# EAGLE schematic BattleBits_V2_manual (EAGLE 9.3.2)
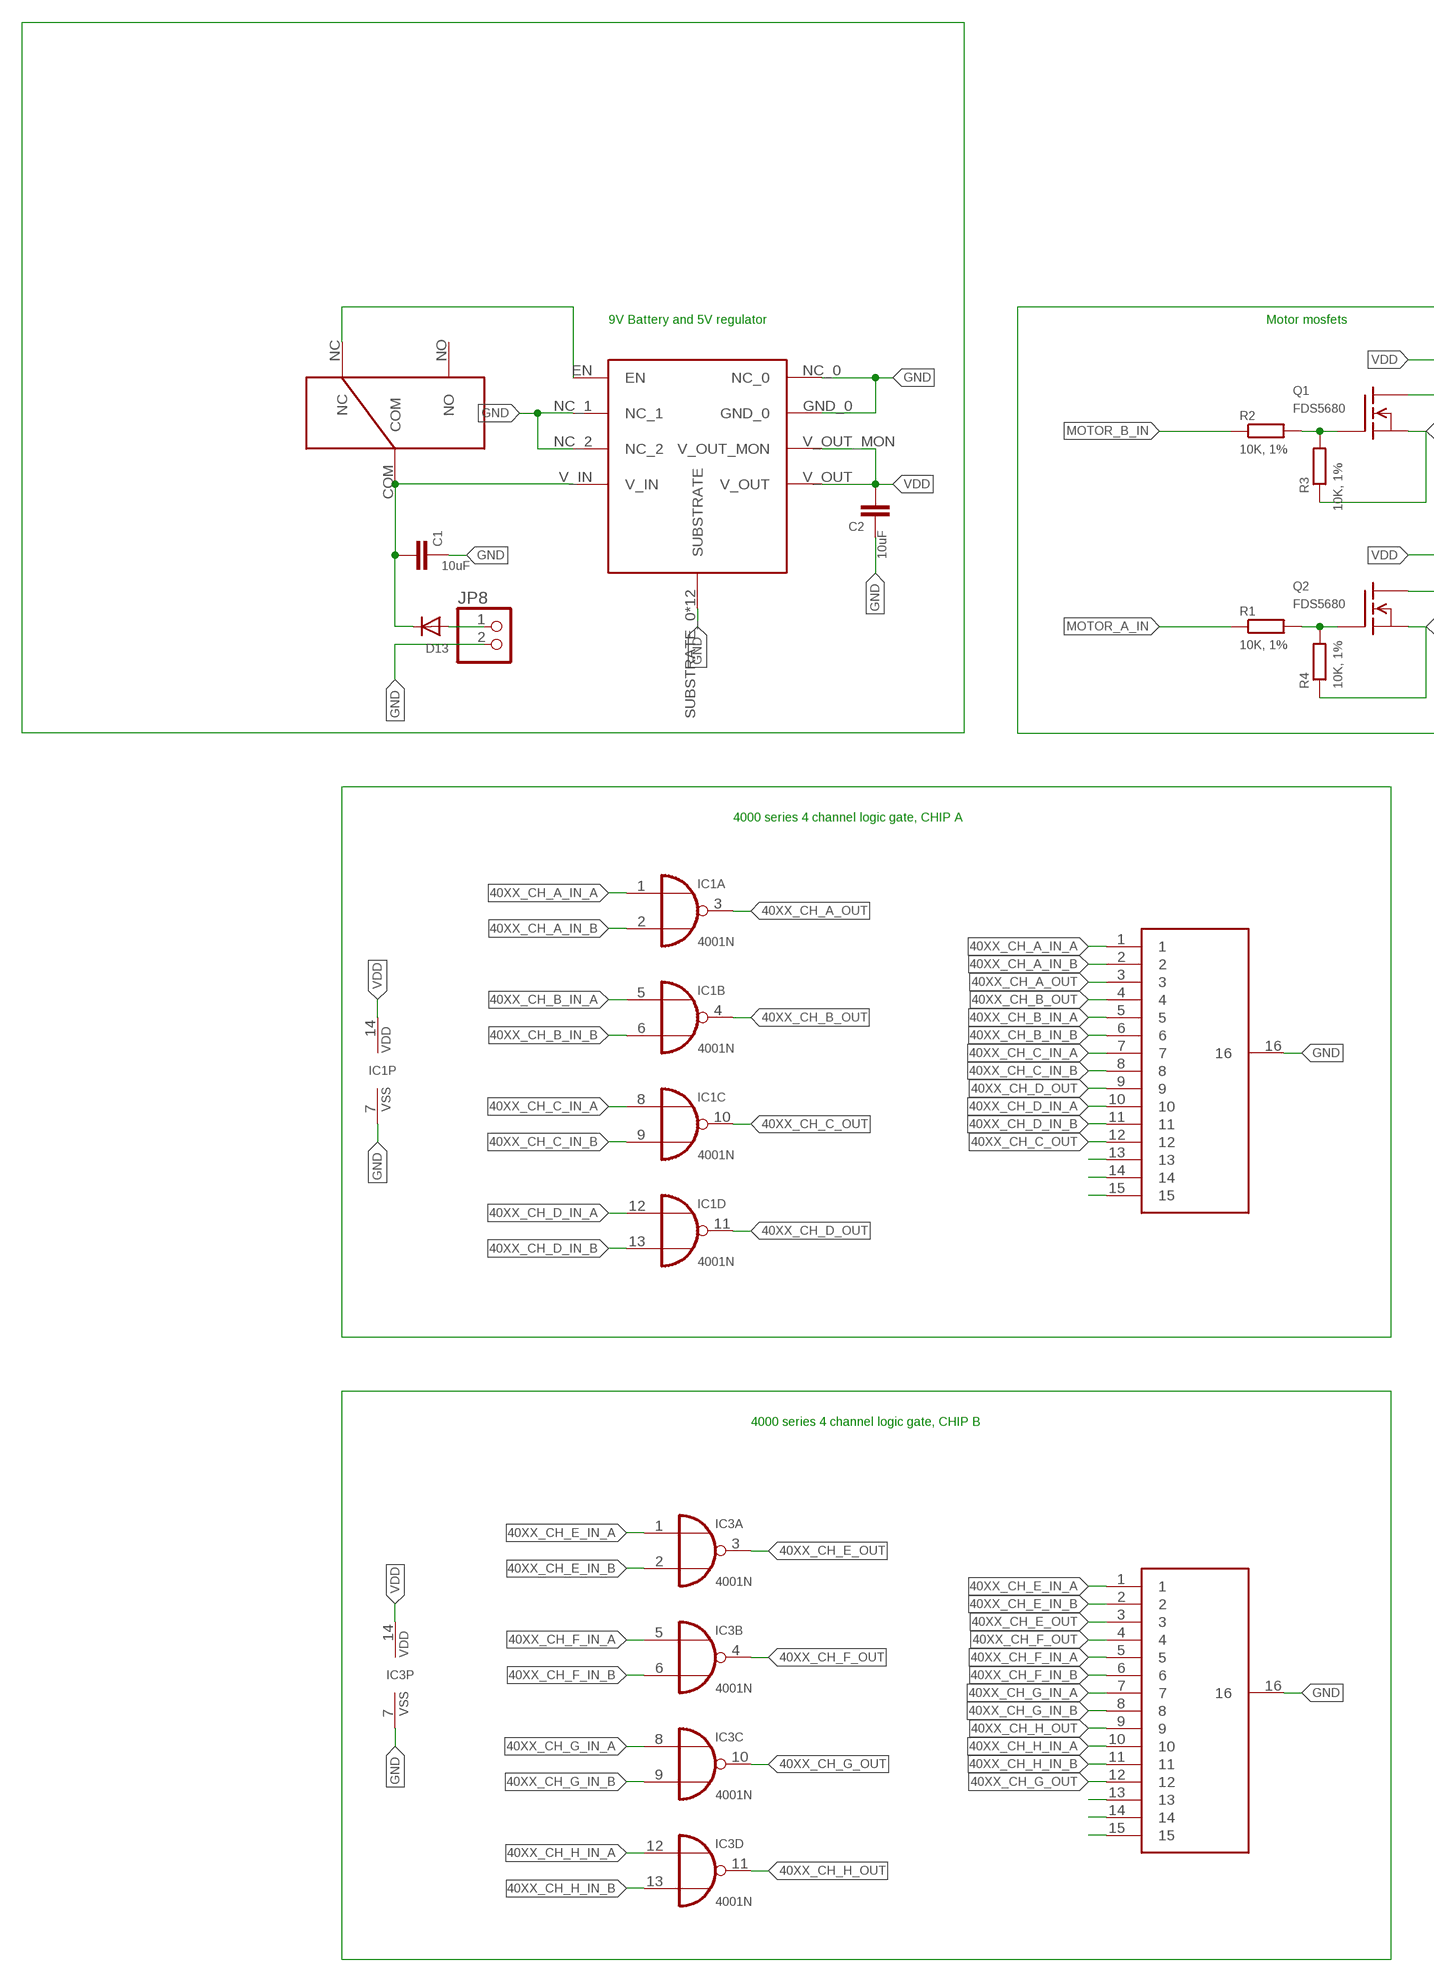
[diagram p0: schematic, sheet 1, part 1 of 2]
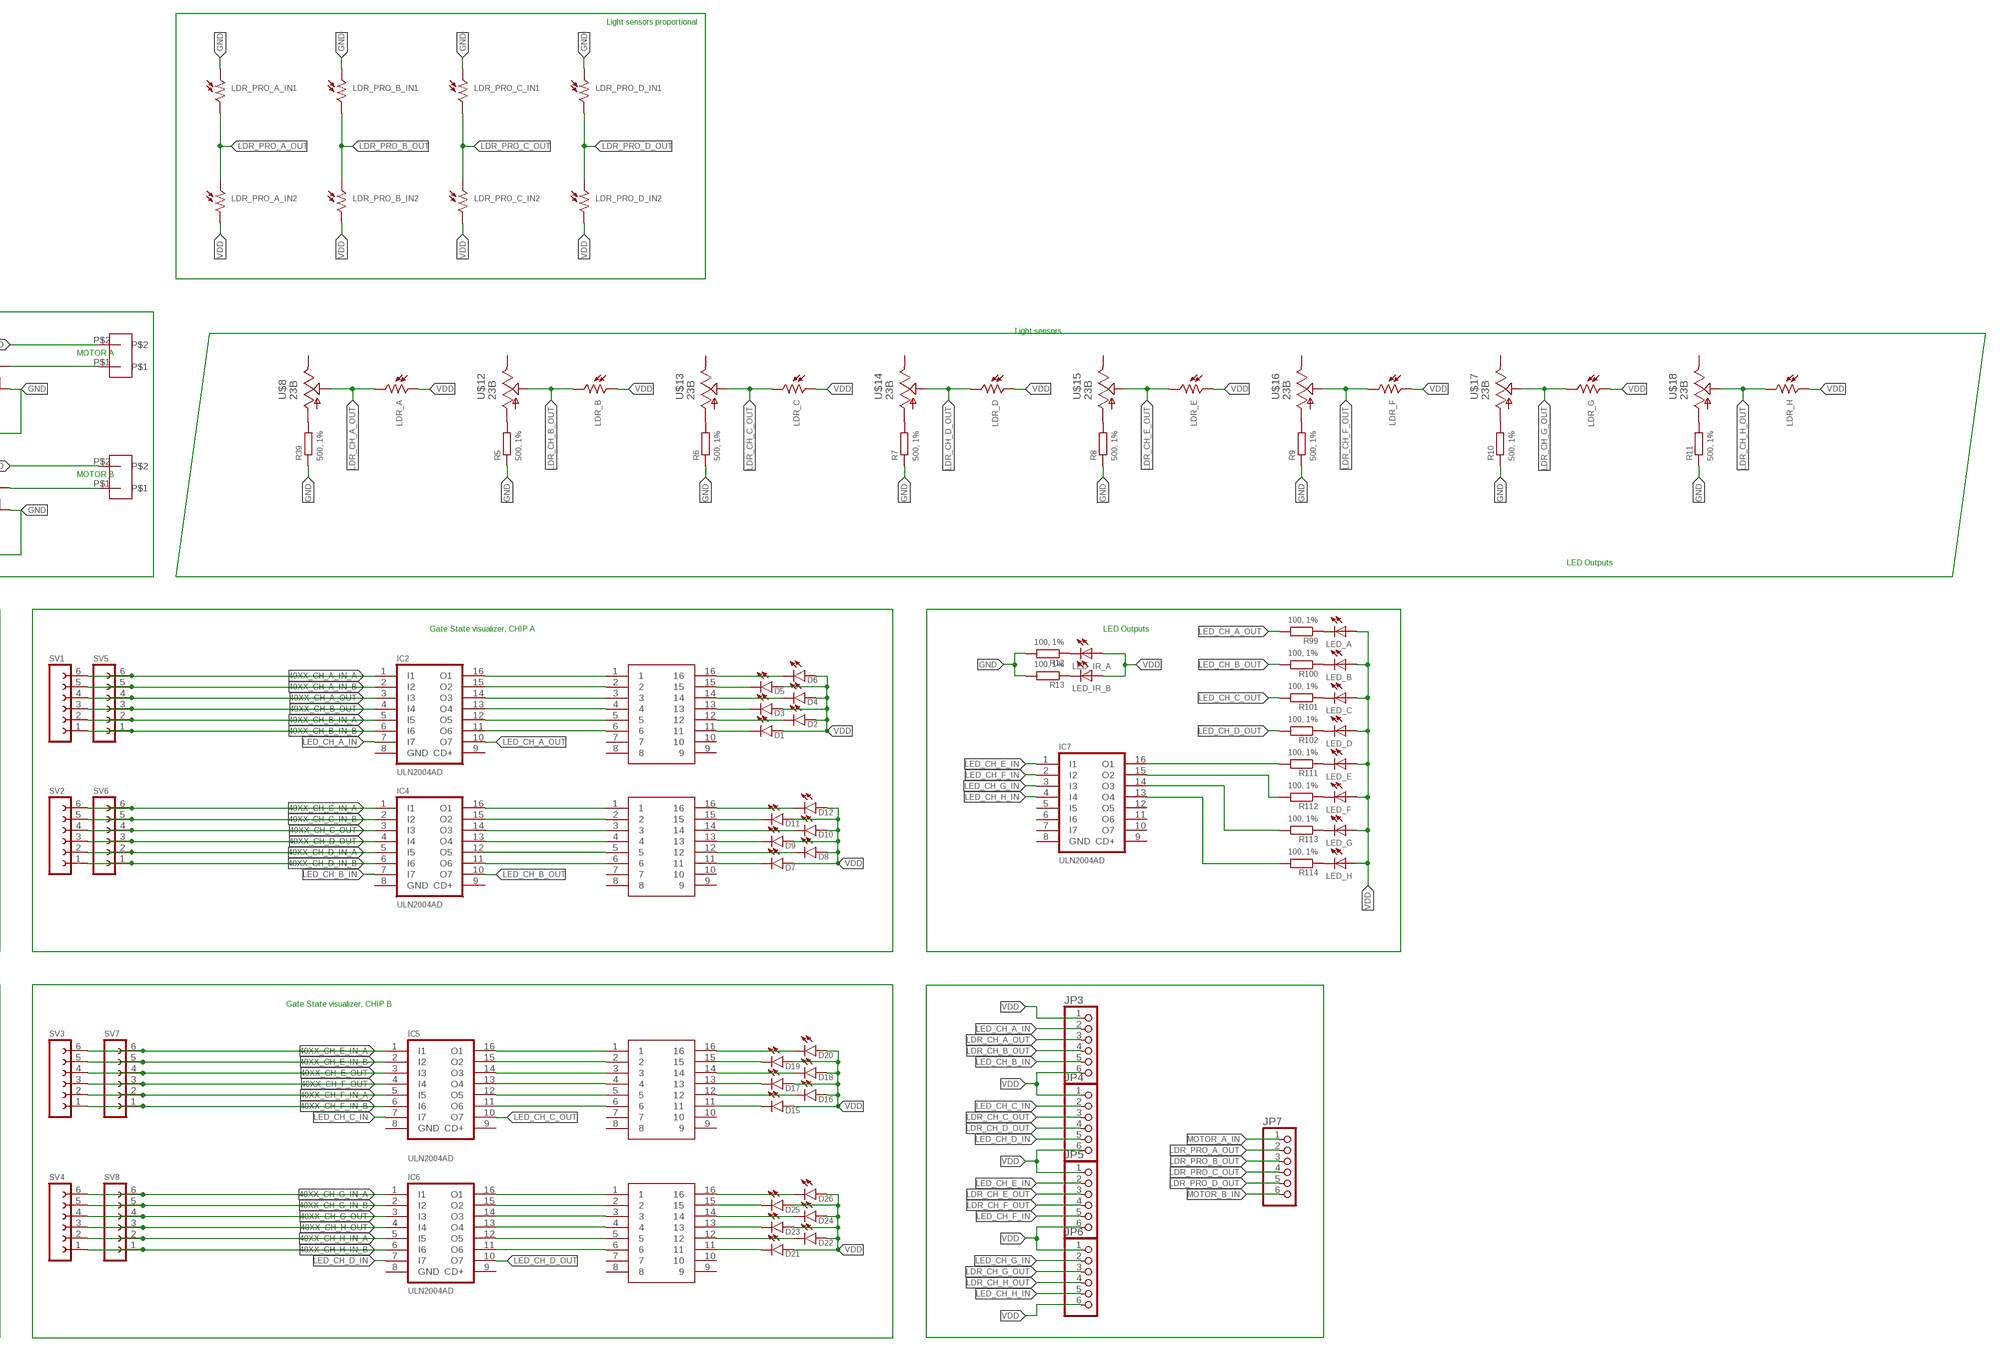
[diagram p1: schematic, sheet 1, part 2 of 2]

## Parts
C1  10uF  C-EUC3216  [C3216]
C2  10uF  C-EUC3216  [C3216]
D1  LED1206  [LED-1206]
D2  LED1206  [LED-1206]
D3  LED1206  [LED-1206]
D4  LED1206  [LED-1206]
D5  LED1206  [LED-1206]
D6  LED1206  [LED-1206]
D7  LED1206  [LED-1206]
D8  LED1206  [LED-1206]
D9  LED1206  [LED-1206]
D10  LED1206  [LED-1206]
D11  LED1206  [LED-1206]
D12  LED1206  [LED-1206]
D13  DIODESMA  [SMADIODE]
D15  LED1206  [LED-1206]
D16  LED1206  [LED-1206]
D17  LED1206  [LED-1206]
D18  LED1206  [LED-1206]
D19  LED1206  [LED-1206]
D20  LED1206  [LED-1206]
D21  LED1206  [LED-1206]
D22  LED1206  [LED-1206]
D23  LED1206  [LED-1206]
D24  LED1206  [LED-1206]
D25  LED1206  [LED-1206]
D26  LED1206  [LED-1206]
IC1  4001N  [DIL14]
IC2  ULN2004AD  [SO16]
IC3  4001N  [DIL14]
IC4  ULN2004AD  [SO16]
IC5  ULN2004AD  [SO16]
IC6  ULN2004AD  [SO16]
IC7  ULN2004AD  [SO16]
JP3  PINHD-1X6  [1X06]
JP4  PINHD-1X6  [1X06]
JP5  PINHD-1X6  [1X06]
JP6  PINHD-1X6  [1X06]
JP7  PINHD-1X6  [1X06]
JP8  PINHD-1X2  [1X02]
LDR_A  V1060_21  [TO-5_V10]
LDR_B  V1060_21  [TO-5_V10]
LDR_C  V1060_21  [TO-5_V10]
LDR_D  V1060_21  [TO-5_V10]
LDR_E  V1060_21  [TO-5_V10]
LDR_F  V1060_21  [TO-5_V10]
LDR_G  V1060_21  [TO-5_V10]
LDR_H  V1060_21  [TO-5_V10]
LDR_PRO_A_IN1  V1060_21  [TO-5_V10]
LDR_PRO_A_IN2  V1060_21  [TO-5_V10]
LDR_PRO_B_IN1  V1060_21  [TO-5_V10]
LDR_PRO_B_IN2  V1060_21  [TO-5_V10]
LDR_PRO_C_IN1  V1060_21  [TO-5_V10]
LDR_PRO_C_IN2  V1060_21  [TO-5_V10]
LDR_PRO_D_IN1  V1060_21  [TO-5_V10]
LDR_PRO_D_IN2  V1060_21  [TO-5_V10]
LED_A  LED5MM  [LED5MM]
LED_B  LED5MM  [LED5MM]
LED_C  LED5MM  [LED5MM]
LED_D  LED5MM  [LED5MM]
LED_E  LED5MM  [LED5MM]
LED_F  LED5MM  [LED5MM]
LED_G  LED5MM  [LED5MM]
LED_H  LED5MM  [LED5MM]
LED_IR_A  LED5MM  [LED5MM]
LED_IR_B  LED5MM  [LED5MM]
Q1  FDS5680  [SO-8]
Q2  FDS5680  [SO-8]
R1  10K, 1%  R-EU_R3216  [R3216]
R2  10K, 1%  R-EU_R3216  [R3216]
R3  10K, 1%  R-EU_R3216  [R3216]
R4  10K, 1%  R-EU_R3216  [R3216]
R5  500, 1%  R-EU_R3216  [R3216]
R6  500, 1%  R-EU_R3216  [R3216]
R7  500, 1%  R-EU_R3216  [R3216]
R8  500, 1%  R-EU_R3216  [R3216]
R9  500, 1%  R-EU_R3216  [R3216]
R10  500, 1%  R-EU_R3216  [R3216]
R11  500, 1%  R-EU_R3216  [R3216]
R12  100, 1%  R-EU_R3216  [R3216]
R13  100, 1%  R-EU_R3216  [R3216]
R39  500, 1%  R-EU_R3216  [R3216]
R99  100, 1%  R-EU_R3216  [R3216]
R100  100, 1%  R-EU_R3216  [R3216]
R101  100, 1%  R-EU_R3216  [R3216]
R102  100, 1%  R-EU_R3216  [R3216]
R111  100, 1%  R-EU_R3216  [R3216]
R112  100, 1%  R-EU_R3216  [R3216]
R113  100, 1%  R-EU_R3216  [R3216]
R114  100, 1%  R-EU_R3216  [R3216]
SV1  FE06-1  [FE06]
SV2  FE06-1  [FE06]
SV3  FE06-1  [FE06]
SV4  FE06-1  [FE06]
SV5  FE06-1  [FE06]
SV6  FE06-1  [FE06]
SV7  FE06-1  [FE06]
SV8  FE06-1  [FE06]
U$1  MOTOR  [GEARMOTOR]
U$2  MOTOR  [GEARMOTOR]
U$3  15_RES_BUS_SOIC16  [SO16]
U$4  ROHM_LDO  [HTSOP-J8]
U$5  8_RES_ISO_SOIC-16  [SO16]
U$6  8_RES_ISO_SOIC-16  [SO16]
U$7  SLIDE_SWITCH  [SLIDE_SWITCH]
U$8  23B  [23B-GULL_WING]
U$9  8_RES_ISO_SOIC-16  [SO16]
U$10  8_RES_ISO_SOIC-16  [SO16]
U$11  15_RES_BUS_SOIC16  [SO16]
U$12  23B  [23B-GULL_WING]
U$13  23B  [23B-GULL_WING]
U$14  23B  [23B-GULL_WING]
U$15  23B  [23B-GULL_WING]
U$16  23B  [23B-GULL_WING]
U$17  23B  [23B-GULL_WING]
U$18  23B  [23B-GULL_WING]

## Nets
40XX_CH_A_IN_A [SIGNAL]: IC1.1(A:I0) IC2.1(I1) SV1.6 SV5.6 U$11.1
40XX_CH_A_IN_B [SIGNAL]: IC1.2(A:I1) IC2.2(I2) SV1.5 SV5.5 U$11.2
40XX_CH_A_OUT [SIGNAL]: IC1.3(A:O) IC2.3(I3) SV1.4 SV5.4 U$11.3
40XX_CH_B_IN_A [SIGNAL]: IC1.5(B:I0) IC2.5(I5) SV1.2 SV5.2 U$11.5
40XX_CH_B_IN_B [SIGNAL]: IC1.6(B:I1) IC2.6(I6) SV1.1 SV5.1 U$11.6
40XX_CH_B_OUT [SIGNAL]: IC1.4(B:O) IC2.4(I4) SV1.3 SV5.3 U$11.4
40XX_CH_C_IN_A [SIGNAL]: IC1.8(C:I0) IC4.1(I1) SV2.6 SV6.6 U$11.7
40XX_CH_C_IN_B [SIGNAL]: IC1.9(C:I1) IC4.2(I2) SV2.5 SV6.5 U$11.8
40XX_CH_C_OUT [SIGNAL]: IC1.10(C:O) IC4.3(I3) SV2.4 SV6.4 U$11.12
40XX_CH_D_IN_A [SIGNAL]: IC1.12(D:I0) IC4.5(I5) SV2.2 SV6.2 U$11.10
40XX_CH_D_IN_B [SIGNAL]: IC1.13(D:I1) IC4.6(I6) SV2.1 SV6.1 U$11.11
40XX_CH_D_OUT [SIGNAL]: IC1.11(D:O) IC4.4(I4) SV2.3 SV6.3 U$11.9
40XX_CH_E_IN_A [SIGNAL]: IC3.1(A:I0) IC5.1(I1) SV3.6 SV7.6 U$3.1
40XX_CH_E_IN_B [SIGNAL]: IC3.2(A:I1) IC5.2(I2) SV3.5 SV7.5 U$3.2
40XX_CH_E_OUT [SIGNAL]: IC3.3(A:O) IC5.3(I3) SV3.4 SV7.4 U$3.3
40XX_CH_F_IN_A [SIGNAL]: IC3.5(B:I0) IC5.5(I5) SV3.2 SV7.2 U$3.5
40XX_CH_F_IN_B [SIGNAL]: IC3.6(B:I1) IC5.6(I6) SV3.1 SV7.1 U$3.6
40XX_CH_F_OUT [SIGNAL]: IC3.4(B:O) IC5.4(I4) SV3.3 SV7.3 U$3.4
40XX_CH_G_IN_A [SIGNAL]: IC3.8(C:I0) IC6.1(I1) SV4.6 SV8.6 U$3.7
40XX_CH_G_IN_B [SIGNAL]: IC3.9(C:I1) IC6.2(I2) SV4.5 SV8.5 U$3.8
40XX_CH_G_OUT [SIGNAL]: IC3.10(C:O) IC6.3(I3) SV4.4 SV8.4 U$3.12
40XX_CH_H_IN_A [SIGNAL]: IC3.12(D:I0) IC6.5(I5) SV4.2 SV8.2 U$3.10
40XX_CH_H_IN_B [SIGNAL]: IC3.13(D:I1) IC6.6(I6) SV4.1 SV8.1 U$3.11
40XX_CH_H_OUT [SIGNAL]: IC3.11(D:O) IC6.4(I4) SV4.3 SV8.3 U$3.9
GND: C1.1 C2.1 IC1.7(P:VSS) IC3.7(P:VSS) JP8.2 LDR_PRO_A_IN1.1 LDR_PRO_B_IN1.1 LDR_PRO_C_IN1.1 LDR_PRO_D_IN1.1 Q1.1(S) Q1.2(S) Q1.3(S) Q2.1(S) Q2.2(S) Q2.3(S) R3.1 R4.1 R5.1 R6.1 R7.1 R8.1 R9.1 R10.1 R11.1 R12.2 R13.2 R39.1 U$3.16 U$4.GND_0 U$4.NC_0 U$4.NC_1 U$4.NC_2 U$4.SUBSTRATE_0(SUBSTRATE) U$4.SUBSTRATE_1(SUBSTRATE) U$4.SUBSTRATE_2(SUBSTRATE) U$4.SUBSTRATE_3(SUBSTRATE) U$4.SUBSTRATE_4(SUBSTRATE) U$4.SUBSTRATE_5(SUBSTRATE) U$4.SUBSTRATE_6(SUBSTRATE) U$4.SUBSTRATE_7(SUBSTRATE) U$4.SUBSTRATE_8(SUBSTRATE) U$4.SUBSTRATE_9(SUBSTRATE) U$4.SUBSTRATE_10(SUBSTRATE) U$4.SUBSTRATE_11(SUBSTRATE) U$11.16
LDR_CH_A_OUT [SIGNAL]: JP3.3 LDR_A.2 U$8.2
LDR_CH_B_OUT: JP3.4 LDR_B.2 U$12.2
LDR_CH_C_OUT [SIGNAL]: JP4.3 LDR_C.2 U$13.2
LDR_CH_D_OUT: JP4.4 LDR_D.2 U$14.2
LDR_CH_E_OUT [SIGNAL]: JP5.3 LDR_E.2 U$15.2
LDR_CH_F_OUT: JP5.4 LDR_F.2 U$16.2
LDR_CH_G_OUT [SIGNAL]: JP6.3 LDR_G.2 U$17.2
LDR_CH_H_OUT: JP6.4 LDR_H.2 U$18.2
LDR_PRO_A_OUT: JP7.2 LDR_PRO_A_IN1.2 LDR_PRO_A_IN2.1
LDR_PRO_B_OUT: JP7.3 LDR_PRO_B_IN1.2 LDR_PRO_B_IN2.1
LDR_PRO_C_OUT: JP7.4 LDR_PRO_C_IN1.2 LDR_PRO_C_IN2.1
LDR_PRO_D_OUT: JP7.5 LDR_PRO_D_IN1.2 LDR_PRO_D_IN2.1
LED_CH_A_IN [SIGNAL]: IC2.7(I7) JP3.2
LED_CH_A_OUT: IC2.10(O7) R99.2
LED_CH_B_IN [SIGNAL]: IC4.7(I7) JP3.5
LED_CH_B_OUT: IC4.10(O7) R100.2
LED_CH_C_IN [SIGNAL]: IC5.7(I7) JP4.2
LED_CH_C_OUT: IC5.10(O7) R101.2
LED_CH_D_IN [SIGNAL]: IC6.7(I7) JP4.5
LED_CH_D_OUT: IC6.10(O7) R102.2
LED_CH_E_IN [SIGNAL]: IC7.1(I1) JP5.2
LED_CH_F_IN [SIGNAL]: IC7.2(I2) JP5.5
LED_CH_G_IN [SIGNAL]: IC7.3(I3) JP6.2
LED_CH_H_IN [SIGNAL]: IC7.4(I4) JP6.5
MOTOR_A-: Q1.5(D) Q1.6(D) Q1.7(D) Q1.8(D) U$1.P$1
MOTOR_A_IN [SIGNAL]: JP7.1 R1.1
MOTOR_B-: Q2.5(D) Q2.6(D) Q2.7(D) Q2.8(D) U$2.P$1
MOTOR_B_IN [SIGNAL]: JP7.6 R2.1
N$5: IC2.16(O1) U$5.1
N$6 [SIGNAL]: Q1.4(G) R2.2 R3.2
N$7 [SIGNAL]: Q2.4(G) R1.2 R4.2
N$8: IC2.15(O2) U$5.2
N$9: IC2.14(O3) U$5.3
N$10: IC2.13(O4) U$5.4
N$11: IC2.12(O5) U$5.5
N$12: IC2.11(O6) U$5.6
N$13: IC6.16(O1) U$10.1
N$14: IC4.16(O1) U$6.1
N$15: IC4.15(O2) U$6.2
N$16: IC4.14(O3) U$6.3
N$17: IC4.13(O4) U$6.4
N$18: IC4.12(O5) U$6.5
N$19: IC4.11(O6) U$6.6
N$20: D6.C U$5.16
N$21: IC6.14(O3) U$10.3
N$22: D5.C U$5.15
N$23: IC5.16(O1) U$9.1
N$24: D4.C U$5.14
N$25: IC5.15(O2) U$9.2
N$26: D3.C U$5.13
N$27: IC5.14(O3) U$9.3
N$28: D2.C U$5.12
N$29: IC5.13(O4) U$9.4
N$30: D1.C U$5.11
N$31: IC5.12(O5) U$9.5
N$32: IC5.11(O6) U$9.6
N$33: IC6.15(O2) U$10.2
N$34: IC6.13(O4) U$10.4
N$35: IC6.12(O5) U$10.5
N$36: D12.C U$6.16
N$37: D11.C U$6.15
N$38: IC6.11(O6) U$10.6
N$39: D10.C U$6.14
N$40: D9.C U$6.13
N$41: D8.C U$6.12
N$42: D7.C U$6.11
N$44 [SIGNAL]: R39.2 U$8.1
N$45 [SIGNAL]: R5.2 U$12.1
N$46: IC7.16(O1) R111.2
N$47: IC7.15(O2) R112.2
N$48: IC7.14(O3) R113.2
N$49: IC7.13(O4) R114.2
N$50 [SIGNAL]: R6.2 U$13.1
N$51 [SIGNAL]: R7.2 U$14.1
N$52 [SIGNAL]: R8.2 U$15.1
N$53 [SIGNAL]: R9.2 U$16.1
N$54 [SIGNAL]: R10.2 U$17.1
N$55 [SIGNAL]: R11.2 U$18.1
N$57: U$3.13
N$58: U$3.14
N$59: U$3.15
N$61: D13.A JP8.1
N$62: U$4.EN U$7.NC
N$63: LED_IR_A.K(C) R12.1
N$64: LED_IR_B.K(C) R13.1
N$74: U$11.13
N$75: U$11.14
N$76: U$11.15
N$86: D20.C U$9.16
N$87: D19.C U$9.15
N$88: D18.C U$9.14
N$89: D17.C U$9.13
N$90: D16.C U$9.12
N$91: D15.C U$9.11
N$92: D26.C U$10.16
N$93: D25.C U$10.15
N$94: D24.C U$10.14
N$95: D23.C U$10.13
N$96: D22.C U$10.12
N$97: D21.C U$10.11
N$111: LED_A.K(C) R99.1
N$112: LED_B.K(C) R100.1
N$113: LED_C.K(C) R101.1
N$114: LED_D.K(C) R102.1
N$123: LED_E.K(C) R111.1
N$124: LED_F.K(C) R112.1
N$125: LED_G.K(C) R113.1
N$126: LED_H.K(C) R114.1
VBAT: C1.2 D13.C U$4.V_IN U$7.COM
VDD: C2.2 D1.A D2.A D3.A D4.A D5.A D6.A D7.A D8.A D9.A D10.A D11.A D12.A D15.A D16.A D17.A D18.A D19.A D20.A D21.A D22.A D23.A D24.A D25.A D26.A IC1.14(P:VDD) IC3.14(P:VDD) JP3.1 JP3.6 JP4.1 JP4.6 JP5.1 JP5.6 JP6.1 JP6.6 LDR_A.1 LDR_B.1 LDR_C.1 LDR_D.1 LDR_E.1 LDR_F.1 LDR_G.1 LDR_H.1 LDR_PRO_A_IN2.2 LDR_PRO_B_IN2.2 LDR_PRO_C_IN2.2 LDR_PRO_D_IN2.2 LED_A.A LED_B.A LED_C.A LED_D.A LED_E.A LED_F.A LED_G.A LED_H.A LED_IR_A.A LED_IR_B.A U$1.P$2 U$2.P$2 U$4.V_OUT U$4.V_OUT_MON
Unconnected: IC2.9(CD+) IC4.9(CD+) IC5.9(CD+) IC6.9(CD+) IC7.5(I5) IC7.6(I6) IC7.7(I7) IC7.9(CD+) IC7.10(O7) IC7.11(O6) IC7.12(O5) U$5.7 U$5.8 U$5.9 U$5.10 U$6.7 U$6.8 U$6.9 U$6.10 U$7.NO U$8.3 U$9.7 U$9.8 U$9.9 U$9.10 U$10.7 U$10.8 U$10.9 U$10.10 U$12.3 U$13.3 U$14.3 U$15.3 U$16.3 U$17.3 U$18.3

## Notes on the sheet
- Light sensors proportional
- 9V Battery and 5V regulator | Motor mosfets
- Light sensors
- MOTOR A
- MOTOR B
- LED Outputs
- 4000 series 4 channel logic gate, CHIP A | Gate State visualizer, CHIP A | LED Outputs
- 4000 series 4 channel logic gate, CHIP B | Gate State visualizer, CHIP B

## Power pins joined to a net without a drawn wire
GND: IC2.8(GND) IC4.8(GND) IC5.8(GND) IC6.8(GND) IC7.8(GND)

## Library data of the parts
C1 C2 = rcl:C-EU: CAPACITOR, European symbol; SPICEPREFIX: C
D1-D12 D15-D26 = SparkFun-LED:LED: LED (Generic) Standard schematic elements and footprints for 5mm, 3mm, 1206, and 0603 sized LEDs. Generic LEDs with no color specified.
D13 = adafruit:DIODE: Diode SMADIODE - SMA Surface Mount Package 20V 1A Schottky Diode Digikey: 641-1014-6-ND DO-1N4148 - Through Hole Small Current Diode SOD-123 20V 1 A (.5mV Vf) Schottky Diode - Digikey: MBRX120TPMSCT-ND SOD-323 10V 570mA (.38mV Vf, 3ns) Schottky Diode - Digikey: ZLLS410CT-ND SOD-523 30V 30mA Schottky Diode (RB751S-40TE61) - Digikey: RB751S-40TE61CT-ND SOT23-R/W - SOT23 Package (R = Solder Paste/Reflow Ovens, W = Hand-Soldering) BAT54Film 40V 300mA - Digikey: 497-7162-1-ND
IC1 IC3 = 40xx:4001: Quad 2-input NOR
IC2 IC4-IC7 = uln-udn:ULN2004A: DRIVER ARRAY
JP3-JP7 = adafruit:PINHD-1X6: PIN HEADER
JP8 = pinhead:PINHD-1X2: PIN HEADER
LDR_A LDR_B LDR_C LDR_D LDR_E LDR_F LDR_G LDR_H LDR_PRO_A_IN1 LDR_PRO_A_IN2 LDR_PRO_B_IN1 LDR_PRO_B_IN2 LDR_PRO_C_IN1 LDR_PRO_C_IN2 LDR_PRO_D_IN1 LDR_PRO_D_IN2 = photo-elements:?1060*: Sensor Street Light control Source: http://optoelectronics.perkinelmer.com/content/Datasheets/DTS_PhotocellsB1060.pdf
LED_A LED_B LED_C LED_D LED_E LED_F LED_G LED_H LED_IR_A LED_IR_B = adafruit:LED: LED OSRAM: - CHIPLED LG R971, LG N971, LY N971, LG Q971, LY Q971, LO R971, LY R971 LH N974, LH R974 LS Q976, LO Q976, LY Q976 LO Q996 - Hyper CHIPLED LW Q18S LB Q993, LB Q99A, LB R99A - SideLED LS A670, LO A670, LY A670, LG A670, LP A670 LB A673, LV A673, LT A673, LW A673 LH A674 LY A675 LS A676, LA A676, LO A676, LY A676, LW A676 LS A679, LY A679, LG A679 - Hyper Micro SIDELED® LS Y876, LA Y876, LO Y876, LY Y876 LT Y87S - SmartLED LW L88C, LW L88S LB L89C, LB L89S, LG L890 LS L89K, LO L89K, LY L89K LS L896, LA L896, LO L896, LY L896 - TOPLED LS T670, LO T670, LY T670, LG T670, LP T670 LSG T670, LSP T670, LSY T670, LOP T670, LYG T670 LG T671, LOG T671, LSG T671 LB T673, LV T673, LT T673, LW T673 LH T674 LS T676, LA T676, LO T676, LY T676, LB T676, LH T676, LSB T676, LW T676 LB T67C, LV T67C, LT T67C, LS T67K, LO T67K, LY T67K, LW E67C LS E67B, LA E67B, LO E67B, LY E67B, LB E67C, LV E67C, LT E67C LW T67C LS T679, LY T679, LG T679 LS T770, LO T770, LY T770, LG T770, LP T770 LB T773, LV T773, LT T773, LW T773 LH T774 LS E675, LA E675, LY E675, LS T675 LS T776, LA T776, LO T776, LY T776, LB T776 LHGB T686 LT T68C, LB T68C - Hyper Mini TOPLED® LB M676 - Mini TOPLED Santana® LG M470 LS M47K, LO M47K, LY M47K Source: http://www.osram.convergy.de/
Q1 Q2 = transistor-fet:FDS5680: 60V N-Channel PowerTrench TM MOSFET FAIRCHILD FDS5680.pdf
R1-R13 R39 R99-R102 R111-R114 = rcl:R-EU_: RESISTOR, European symbol; SPICEPREFIX: R
SV1-SV8 = con-lsta:FE06-1: FEMALE HEADER; OC_FARNELL: unknown; OC_NEWARK: unknown
U$1 U$2 = gearmotor:MOTOR
U$3 U$11 = resistorArrayBus:15_RES_BUS_SOIC16
U$4 = Rohm-ldo:ROHM_LDO
U$5 U$6 U$9 U$10 = resistorArrayBus:8_RES_ISO_SOIC-16
U$7 = SlideSwitch:SLIDE_SWITCH
U$8 U$12-U$18 = bourns_trimpot:23B

## Net classes
0 PWR: width 0.305 mm, drill 0.3 mm, clearance 0.152 mm
1 SIGNAL: width 0.305 mm, drill 0.3 mm, clearance 0.152 mm